# EAGLE schematic Schematic2 (EAGLE 6.5.0)
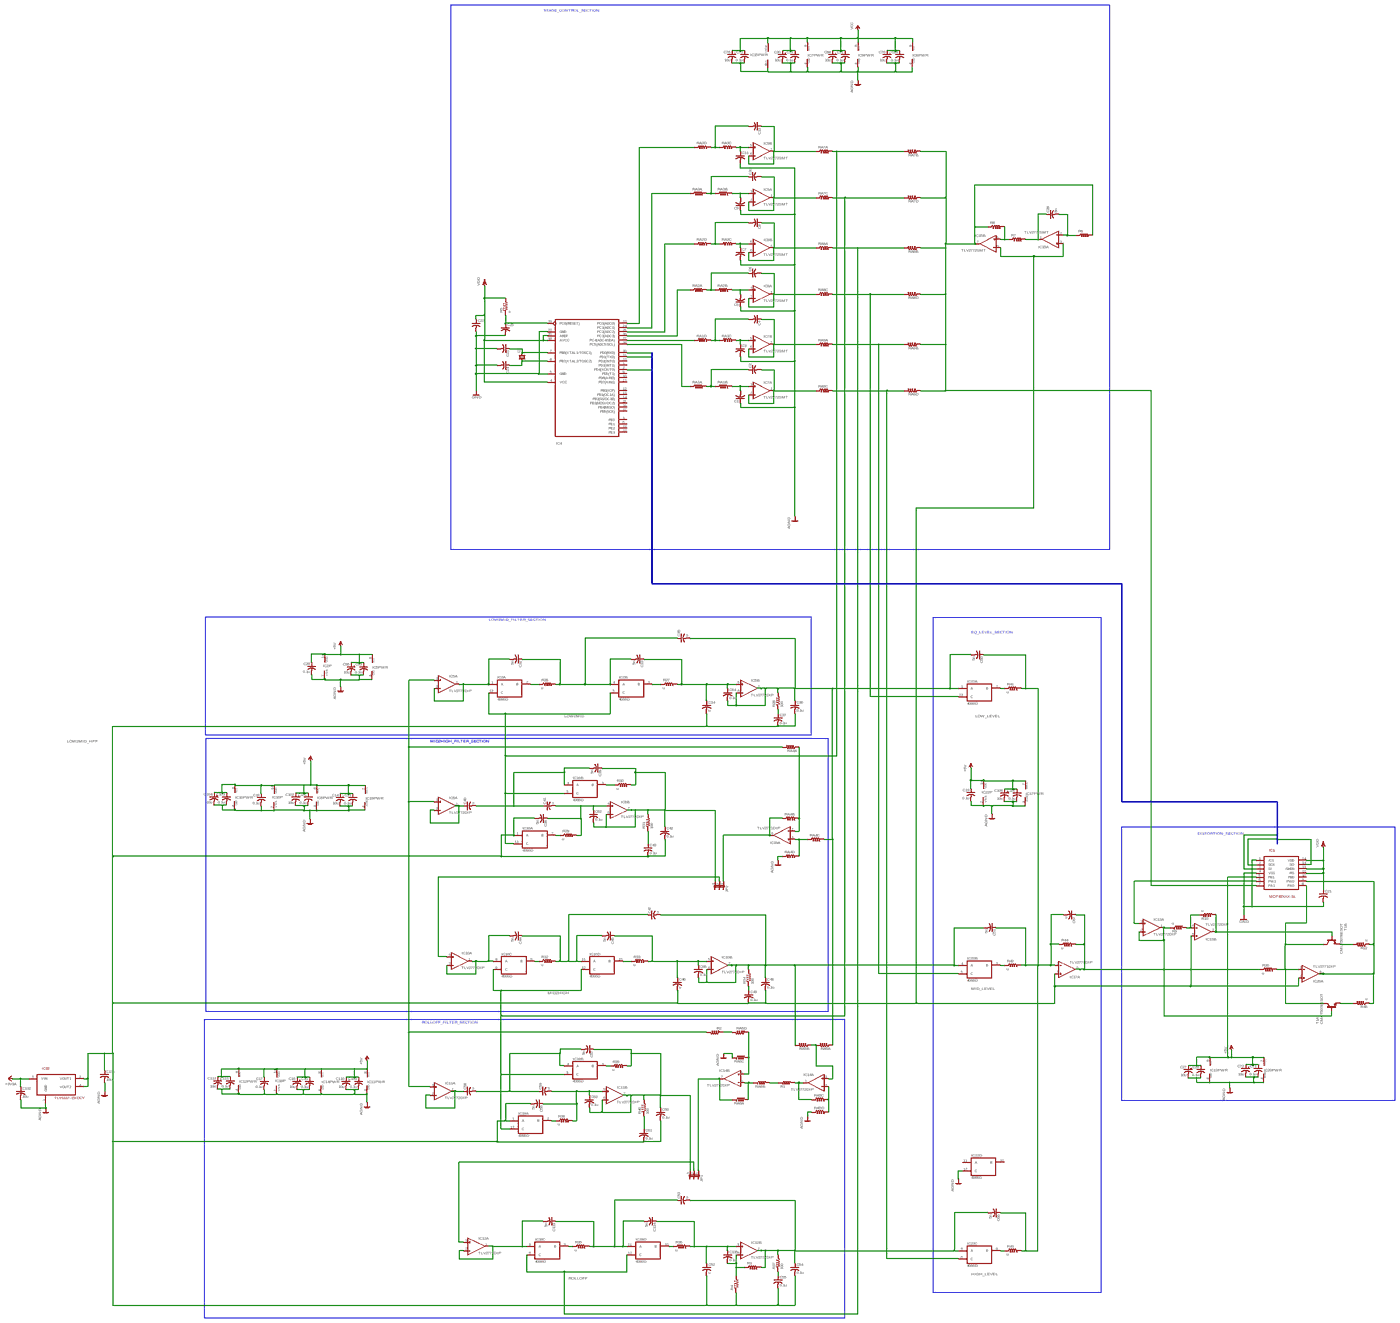
[diagram p0: schematic, sheet 1, overview]
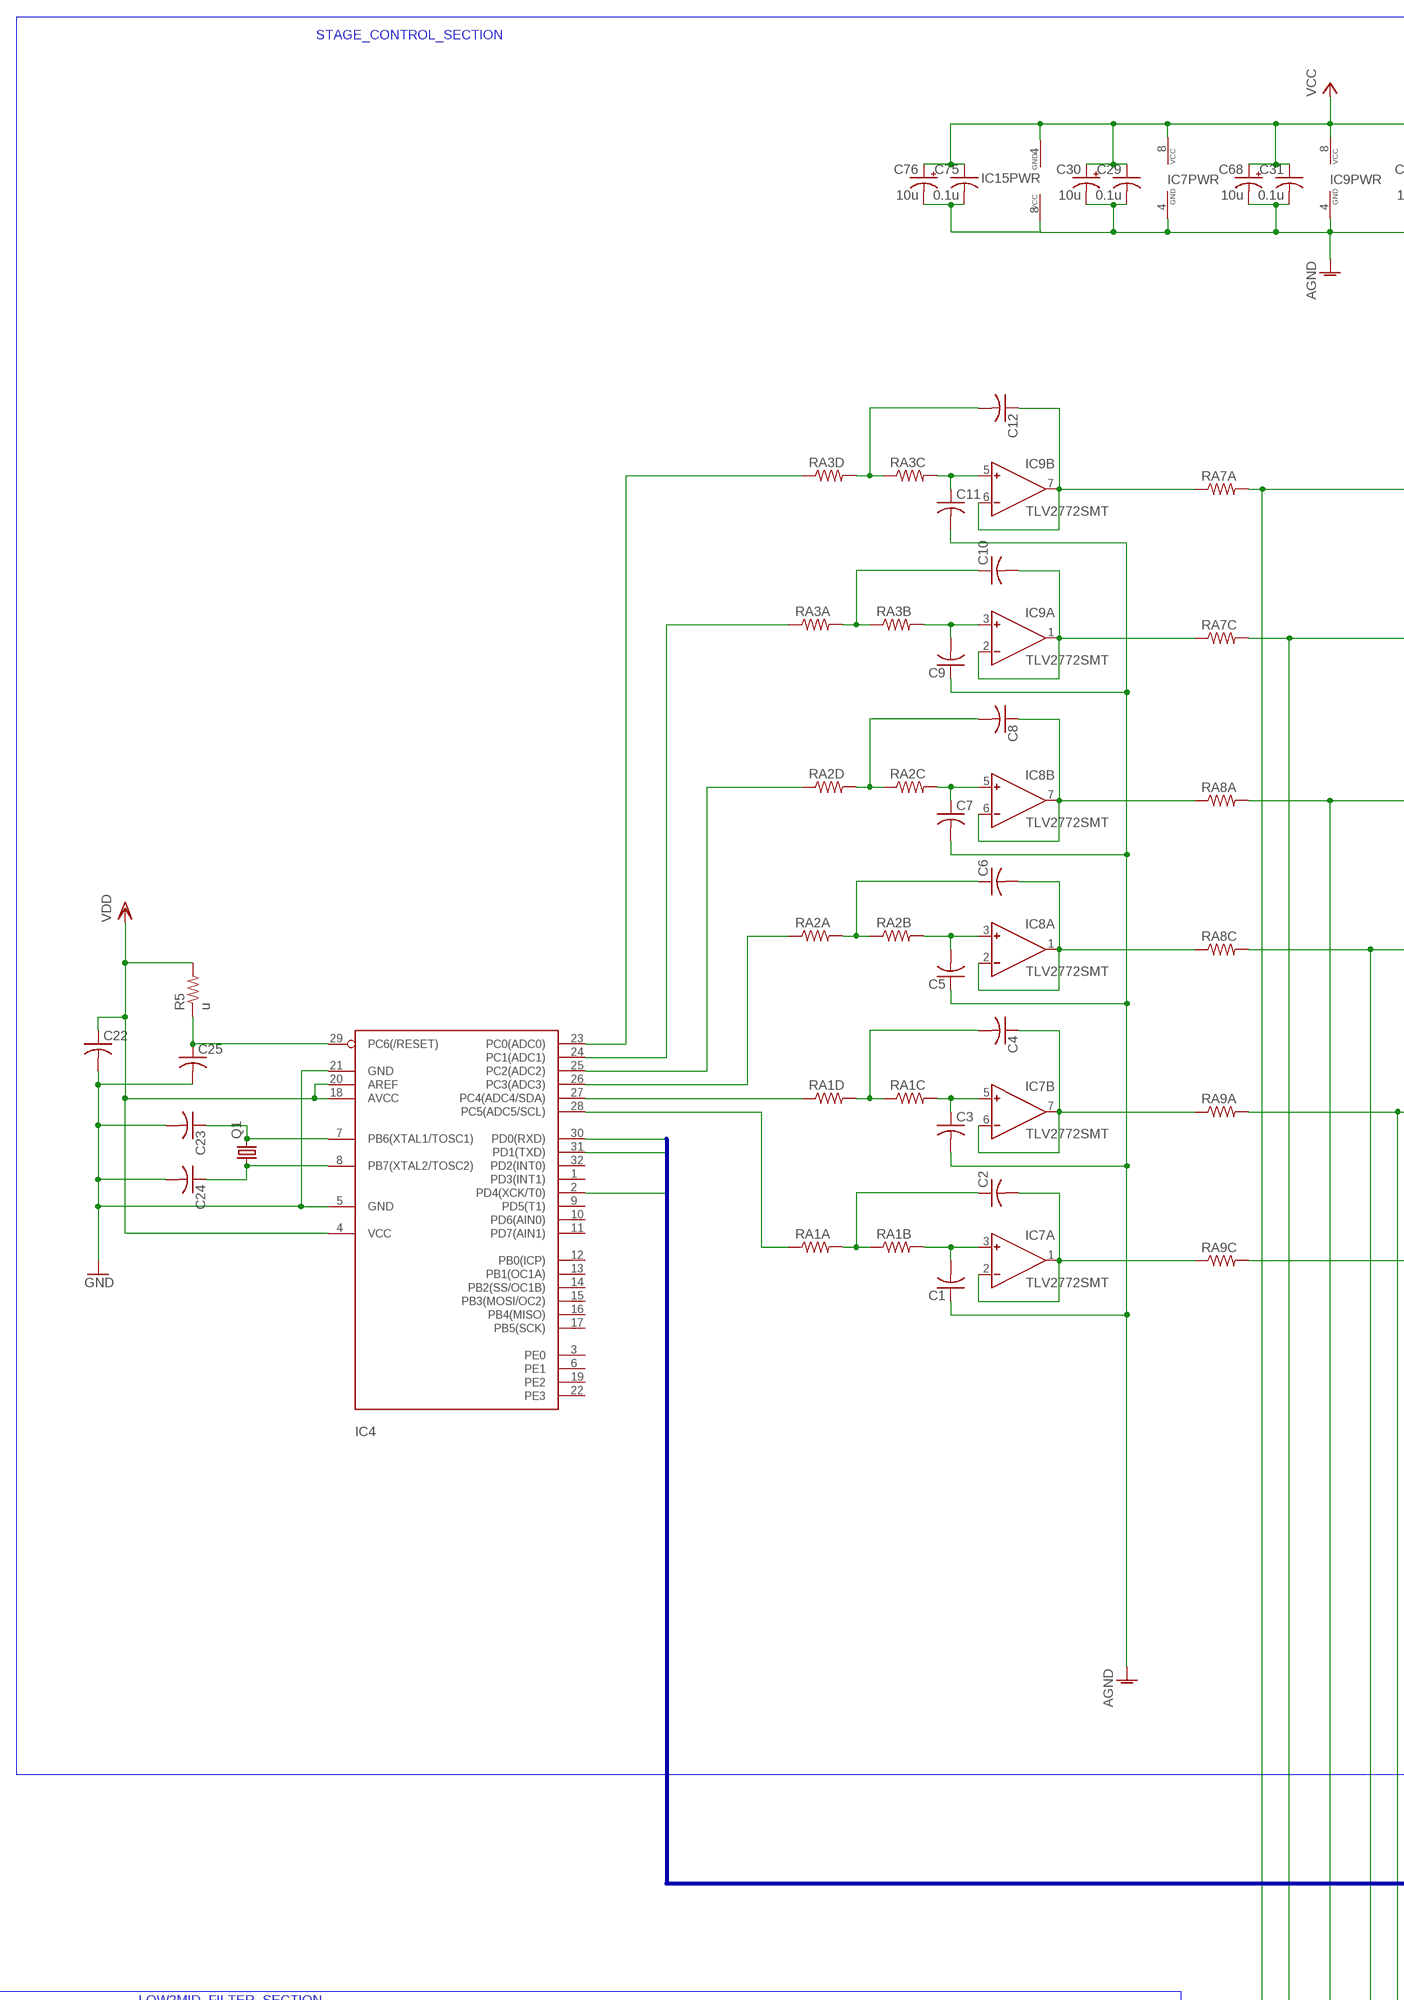
[diagram p1: schematic, sheet 1, part 1 of 4]
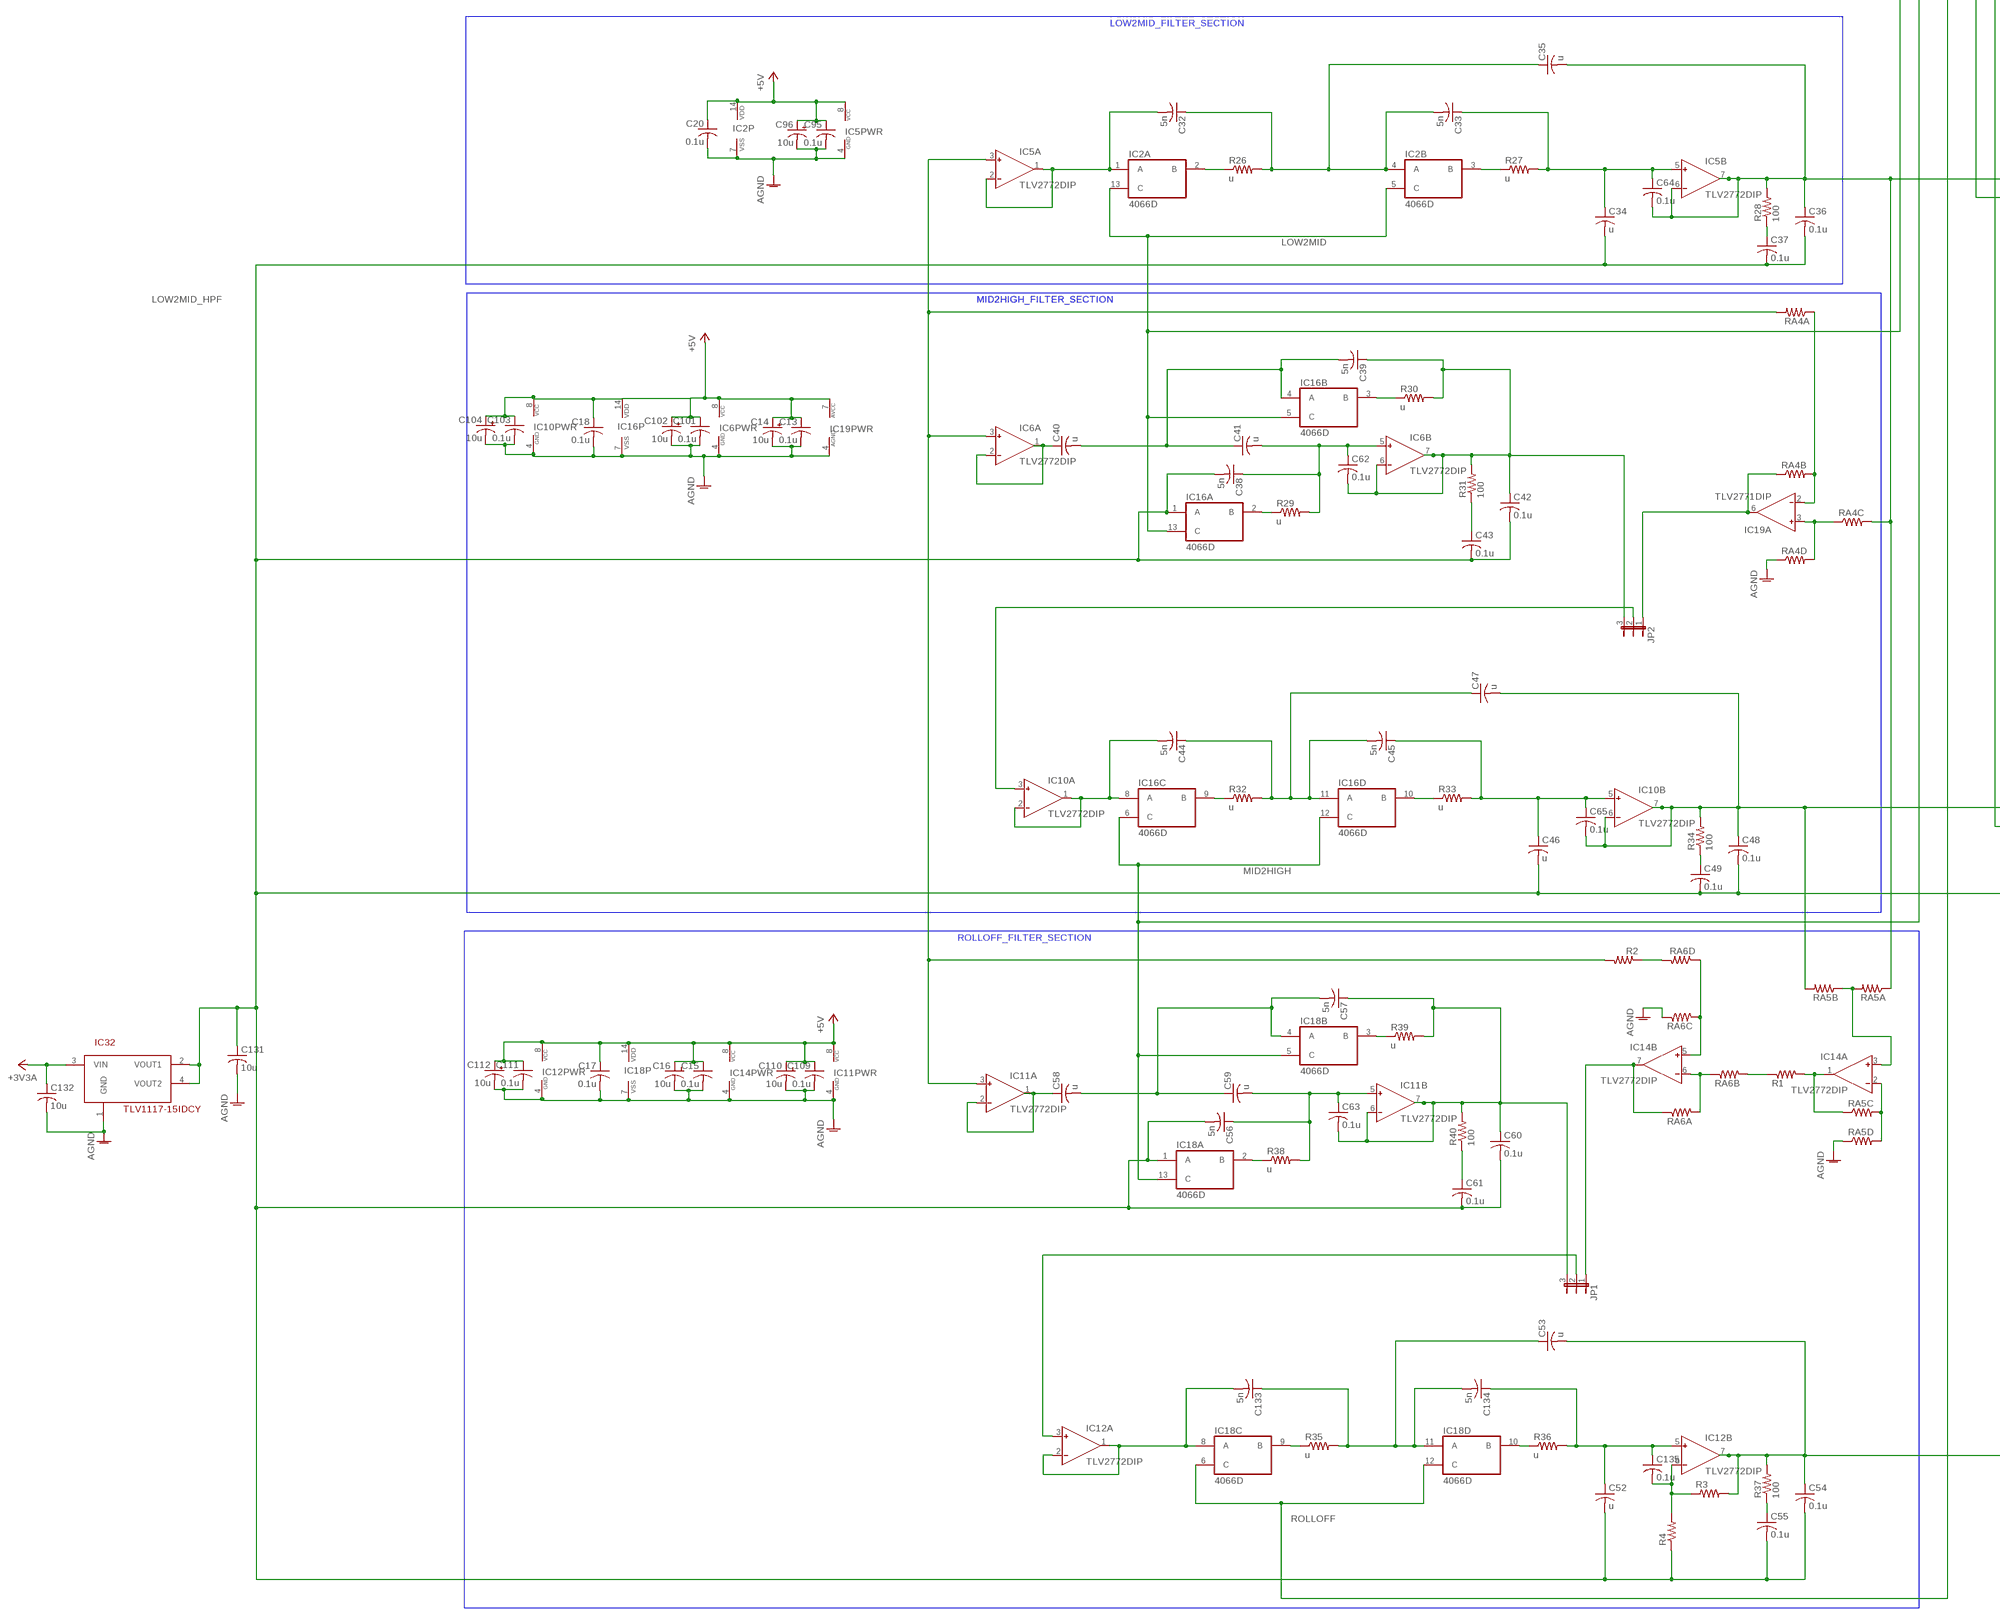
[diagram p2: schematic, sheet 1, part 2 of 4]
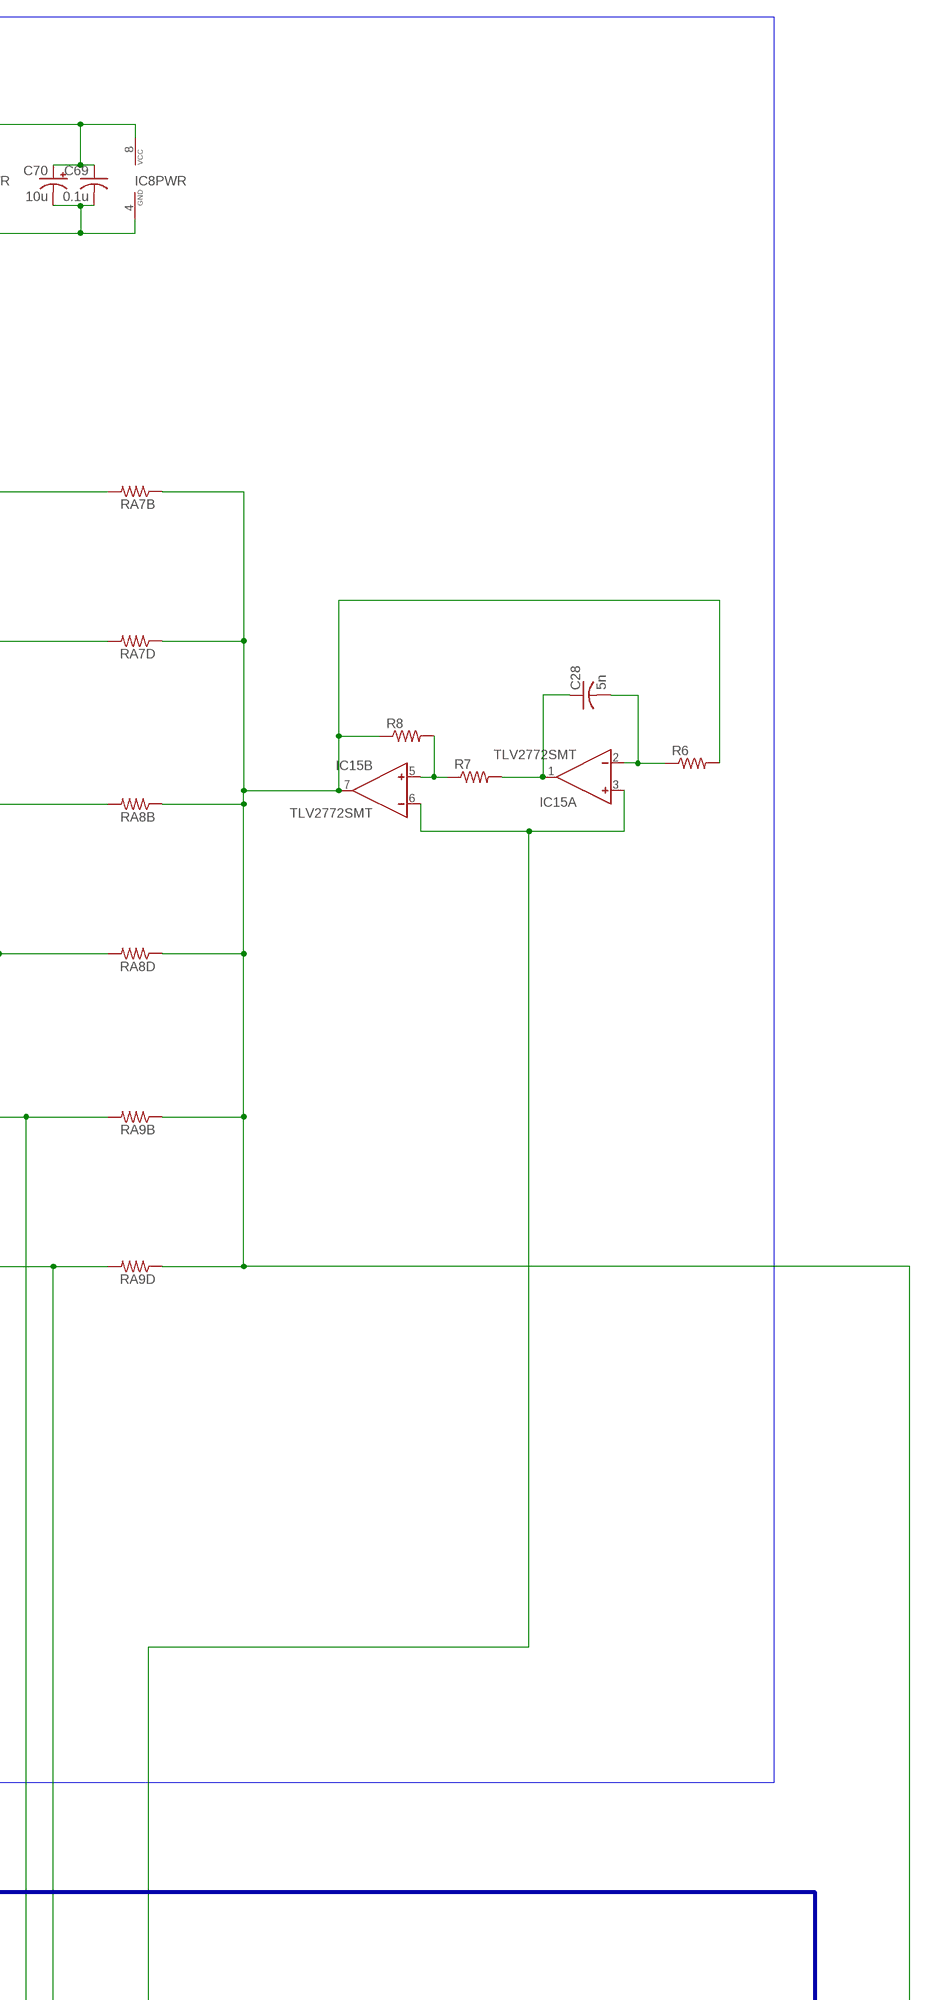
[diagram p3: schematic, sheet 1, part 3 of 4]
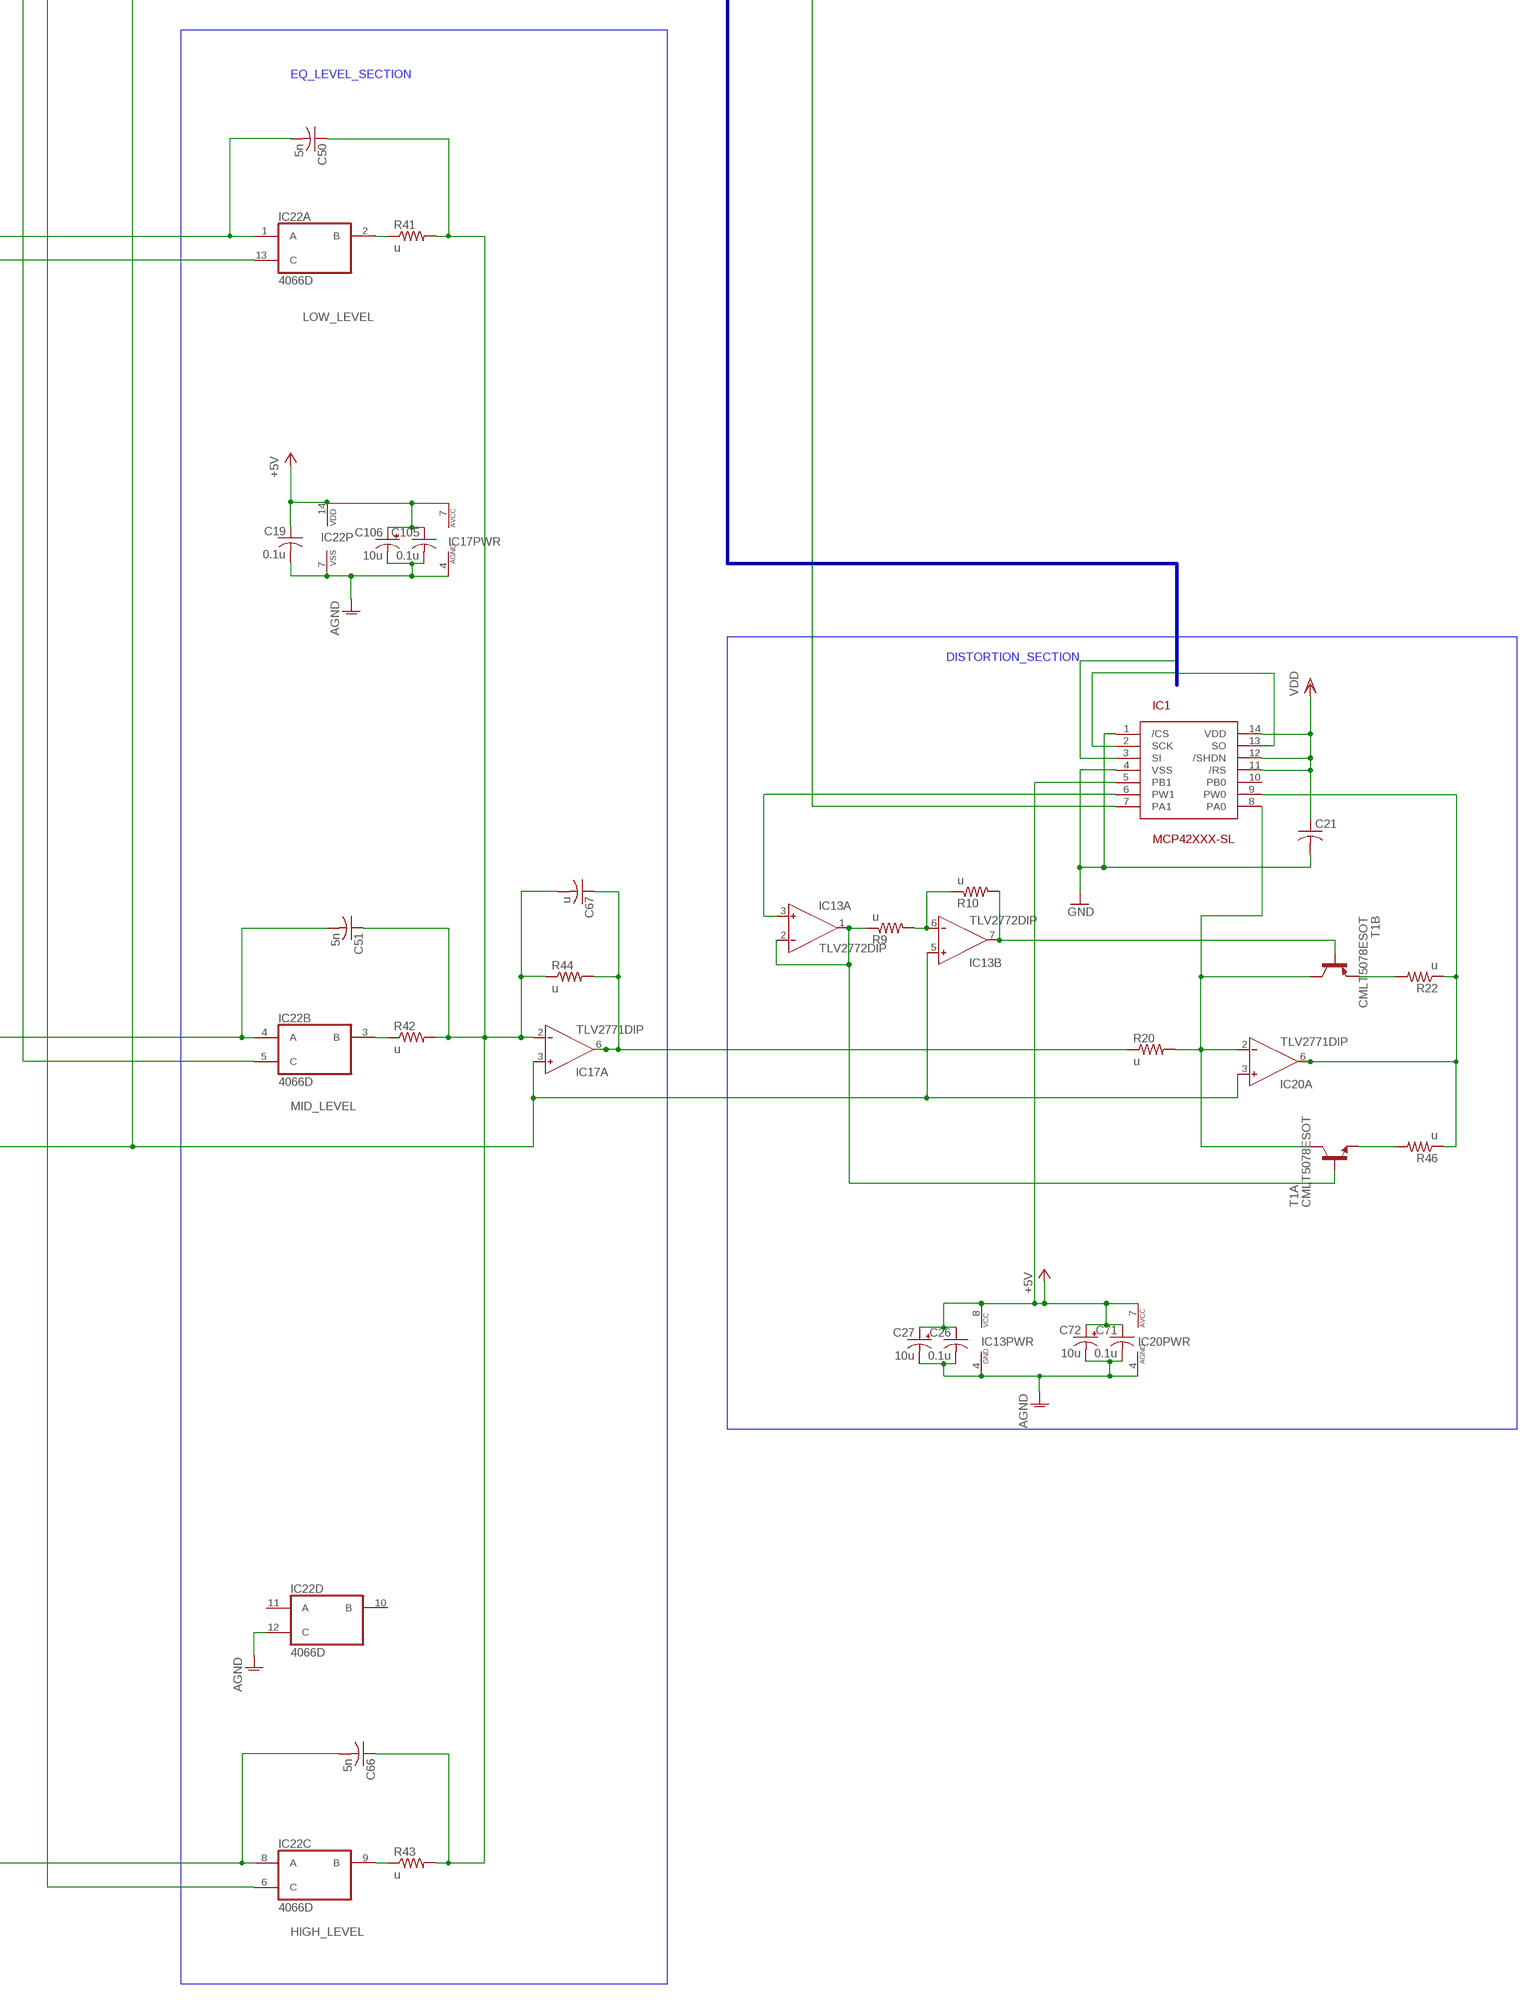
[diagram p4: schematic, sheet 1, part 4 of 4]

## Parts
C1  C-USC0805  [C0805]
C2  C-USC0805  [C0805]
C3  C-USC0805  [C0805]
C4  C-USC0805  [C0805]
C5  C-USC0805  [C0805]
C6  C-USC0805  [C0805]
C7  C-USC0805  [C0805]
C8  C-USC0805  [C0805]
C9  C-USC0805  [C0805]
C10  C-USC0805  [C0805]
C11  C-USC0805  [C0805]
C12  C-USC0805  [C0805]
C13  0.1u  C-USC0805  [C0805]
C14  10u  CPOL-USA/3216-18R  [A/3216-18R]
C15  0.1u  C-USC0805  [C0805]
C16  10u  CPOL-USA/3216-18R  [A/3216-18R]
C17  0.1u  C-USC0805  [C0805]
C18  0.1u  C-USC0805  [C0805]
C19  0.1u  C-USC0805  [C0805]
C20  0.1u  C-USC0805  [C0805]
C21  C-USC0805  [C0805]
C22  C-USC0805  [C0805]
C23  C-USC0805  [C0805]
C24  C-USC0805  [C0805]
C25  C-USC0805  [C0805]
C26  0.1u  C-USC0805  [C0805]
C27  10u  CPOL-USA/3216-18R  [A/3216-18R]
C28  5n  C-USC0805  [C0805]
C29  0.1u  C-USC0805  [C0805]
C30  10u  CPOL-USA/3216-18R  [A/3216-18R]
C31  0.1u  C-USC0805  [C0805]
C32  5n  C-USC0805  [C0805]
C33  5n  C-USC0805  [C0805]
C34  u  C-USC0805  [C0805]
C35  u  C-USC0805  [C0805]
C36  0.1u  C-USC0805  [C0805]
C37  0.1u  C-USC0805  [C0805]
C38  5n  C-USC0805  [C0805]
C39  5n  C-USC0805  [C0805]
C40  u  C-USC0805  [C0805]
C41  u  C-USC0805  [C0805]
C42  0.1u  C-USC0805  [C0805]
C43  0.1u  C-USC0805  [C0805]
C44  5n  C-USC0805  [C0805]
C45  5n  C-USC0805  [C0805]
C46  u  C-USC0805  [C0805]
C47  u  C-USC0805  [C0805]
C48  0.1u  C-USC0805  [C0805]
C49  0.1u  C-USC0805  [C0805]
C50  5n  C-USC0805  [C0805]
C51  5n  C-USC0805  [C0805]
C52  u  C-USC0805  [C0805]
C53  u  C-USC0805  [C0805]
C54  0.1u  C-USC0805  [C0805]
C55  0.1u  C-USC0805  [C0805]
C56  5n  C-USC0805  [C0805]
C57  5n  C-USC0805  [C0805]
C58  u  C-USC0805  [C0805]
C59  u  C-USC0805  [C0805]
C60  0.1u  C-USC0805  [C0805]
C61  0.1u  C-USC0805  [C0805]
C62  0.1u  C-USC0805  [C0805]
C63  0.1u  C-USC0805  [C0805]
C64  0.1u  C-USC0805  [C0805]
C65  0.1u  C-USC0805  [C0805]
C66  5n  C-USC0805  [C0805]
C67  u  C-USC0805  [C0805]
C68  10u  CPOL-USA/3216-18R  [A/3216-18R]
C69  0.1u  C-USC0805  [C0805]
C70  10u  CPOL-USA/3216-18R  [A/3216-18R]
C71  0.1u  C-USC0805  [C0805]
C72  10u  CPOL-USA/3216-18R  [A/3216-18R]
C75  0.1u  C-USC0805  [C0805]
C76  10u  CPOL-USA/3216-18R  [A/3216-18R]
C95  0.1u  C-USC0805  [C0805]
C96  10u  CPOL-USA/3216-18R  [A/3216-18R]
C101  0.1u  C-USC0805  [C0805]
C102  10u  CPOL-USA/3216-18R  [A/3216-18R]
C103  0.1u  C-USC0805  [C0805]
C104  10u  CPOL-USA/3216-18R  [A/3216-18R]
C105  0.1u  C-USC0805  [C0805]
C106  10u  CPOL-USA/3216-18R  [A/3216-18R]
C109  0.1u  C-USC0805  [C0805]
C110  10u  CPOL-USA/3216-18R  [A/3216-18R]
C111  0.1u  C-USC0805  [C0805]
C112  10u  CPOL-USA/3216-18R  [A/3216-18R]
C131  10u  C-USC0805  [C0805]
C132  10u  C-USC0805  [C0805]
C133  5n  C-USC0805  [C0805]
C134  5n  C-USC0805  [C0805]
C135  0.1u  C-USC0805  [C0805]
IC1  MCP42XXX-SL  [SO-14]
IC2  4066D  [SO14]
IC4  ATMEGA168-A  [TQFP32-08]
IC5  TLV2772DIP  [DIL08]
IC6  TLV2772DIP  [DIL08]
IC7  TLV2772SMT  [SO-08]
IC8  TLV2772SMT  [SO-08]
IC9  TLV2772SMT  [SO-08]
IC10  TLV2772DIP  [DIL08]
IC11  TLV2772DIP  [DIL08]
IC12  TLV2772DIP  [DIL08]
IC13  TLV2772DIP  [DIL08]
IC14  TLV2772DIP  [DIL08]
IC15  TLV2772SMT  [SO-08]
IC16  4066D  [SO14]
IC17  TLV2771DIP  [DIL08]
IC18  4066D  [SO14]
IC19  TLV2771DIP  [DIL08]
IC20  TLV2771DIP  [DIL08]
IC22  4066D  [SO14]
IC32  TLV1117-15IDCY  [SOT223-4]
JP1  JP2ES  [JP2]
JP2  JP2ES  [JP2]
Q1  CRYTALHC49UP  [HC49UP]
R1  R-US_R0805  [R0805]
R2  R-US_R0805  [R0805]
R3  R-US_R0805  [R0805]
R4  R-US_R0805  [R0805]
R5  u  R-US_R0805  [R0805]
R6  R-US_R0805  [R0805]
R7  R-US_R0805  [R0805]
R8  R-US_R0805  [R0805]
R9  u  R-US_R0805  [R0805]
R10  u  R-US_R0805  [R0805]
R20  u  R-US_R0805  [R0805]
R22  u  R-US_R0805  [R0805]
R26  u  R-US_R0805  [R0805]
R27  u  R-US_R0805  [R0805]
R28  100  R-US_R0805  [R0805]
R29  u  R-US_R0805  [R0805]
R30  u  R-US_R0805  [R0805]
R31  100  R-US_R0805  [R0805]
R32  u  R-US_R0805  [R0805]
R33  u  R-US_R0805  [R0805]
R34  100  R-US_R0805  [R0805]
R35  u  R-US_R0805  [R0805]
R36  u  R-US_R0805  [R0805]
R37  100  R-US_R0805  [R0805]
R38  u  R-US_R0805  [R0805]
R39  u  R-US_R0805  [R0805]
R40  100  R-US_R0805  [R0805]
R41  u  R-US_R0805  [R0805]
R42  u  R-US_R0805  [R0805]
R43  u  R-US_R0805  [R0805]
R44  u  R-US_R0805  [R0805]
R46  u  R-US_R0805  [R0805]
RA1  4_R2  [YC324]
RA2  4_R2  [YC324]
RA3  4_R2  [YC324]
RA4  4_R2  [YC324]
RA5  4_R2  [YC324]
RA6  4_R2  [YC324]
RA7  4_R2  [YC324]
RA8  4_R2  [YC324]
RA9  4_R2  [YC324]
T1  CMLT5078ESOT  [SOT563]

## Nets
+3V3A: C132.1 IC32.3(VIN)
+5V: C13.1 C14.+ C15.1 C16.+ C17.1 C18.1 C19.1 C20.1 C26.1 C27.+ C71.1 C72.+ C95.1 C96.+ C101.1 C102.+ C103.1 C104.+ C105.1 C106.+ C109.1 C110.+ C111.1 C112.+ IC1.5(PB1) IC2.14(P:VDD) IC5.8(PWR:VCC) IC6.8(PWR:VCC) IC10.8(PWR:VCC) IC11.8(PWR:VCC) IC12.8(PWR:VCC) IC13.8(PWR:VCC) IC14.8(PWR:VCC) IC16.14(P:VDD) IC17.7(PWR:AVCC) IC18.14(P:VDD) IC19.7(PWR:AVCC) IC20.7(PWR:AVCC) IC22.14(P:VDD)
AGND: C1.1 C3.2 C5.1 C7.2 C9.1 C11.2 C13.2 C14.- C15.2 C16.- C17.2 C18.2 C19.2 C20.2 C26.2 C27.- C29.2 C30.- C31.2 C68.- C69.2 C70.- C71.2 C72.- C75.2 C76.- C95.2 C96.- C101.2 C102.- C103.2 C104.- C105.2 C106.- C109.2 C110.- C111.2 C112.- C131.2 C132.2 IC2.7(P:VSS) IC5.4(PWR:GND) IC6.4(PWR:GND) IC7.4(PWR:GND) IC8.4(PWR:GND) IC9.4(PWR:GND) IC10.4(PWR:GND) IC11.4(PWR:GND) IC12.4(PWR:GND) IC13.4(PWR:GND) IC14.4(PWR:GND) IC15.8(PWR:VCC) IC16.7(P:VSS) IC17.4(PWR:AGND) IC18.7(P:VSS) IC19.4(PWR:AGND) IC20.4(PWR:AGND) IC22.7(P:VSS) IC32.1(GND) RA4.4 RA5.4 RA6.3
GND: C21.2 C22.2 C23.2 C24.2 C25.2 IC1.1(/CS) IC1.4(VSS) IC4.5(GND) IC4.21(GND)
HIGH_LEVEL_CV: C2.2 IC7.1(A:OUT) IC7.2(A:IN-) RA9.3
LOW2MID: IC2.5(B:C) IC2.13(A:C) IC16.5(B:C) IC16.13(A:C) RA7.7 RA7.8
LOW2MID_CV: C12.1 IC9.6(B:IN-) IC9.7(B:OUT) RA7.1
LOW_LEVEL_CV: C6.2 IC8.1(A:OUT) IC8.2(A:IN-) RA8.3
MID2HIGH: IC16.6(C:C) IC16.12(D:C) IC18.5(B:C) IC18.13(A:C) RA7.5 RA7.6
MID2HIGH_CV: C10.2 IC9.1(A:OUT) IC9.2(A:IN-) RA7.3
MID_LEVEL_CV: C4.1 IC7.6(B:IN-) IC7.7(B:OUT) RA9.1
MISO: IC1.13(SO) IC4.30(PD0(RXD))
MOSI: IC1.3(SI) IC4.31(PD1(TXD))
N$1: IC22.12(D:C)
N$4: IC10.3(A:IN+) JP2.2
N$5: C44.1 C45.2 C47.1 IC16.11(D:A) R32.2
N$6: IC22.2(A:B) R41.1
N$7: IC16.10(D:B) R33.1
N$8: R22.2 T1.4(B:E)
N$9: R46.2 T1.1(A:E)
N$10: C4.2 RA1.3 RA1.5
N$11: IC1.7(PA1) IC15.7(B:OUT) R6.2 R8.1 RA7.2 RA7.4 RA8.2 RA8.4 RA9.2 RA9.4
N$12: IC15.5(B:IN+) R7.1 R8.2
N$13: C2.1 RA1.2 RA1.8
N$14: C3.1 IC7.5(B:IN+) RA1.6
N$15: C1.2 IC7.3(A:IN+) RA1.7
N$16: IC4.24(PC1(ADC1)) RA3.1
N$17: C28.1 IC15.1(A:OUT) R7.2
N$19: C7.1 IC8.5(B:IN+) RA2.6
N$20: C5.2 IC8.3(A:IN+) RA2.7
N$21: C6.1 RA2.2 RA2.8
N$22: C8.2 RA2.3 RA2.5
N$23: C28.2 IC15.2(A:IN-) R6.1
N$25: C11.1 IC9.5(B:IN+) RA3.6
N$26: C9.2 IC9.3(A:IN+) RA3.7
N$27: C10.1 RA3.2 RA3.8
N$28: C12.2 RA3.3 RA3.5
N$29: IC4.27(PC4(ADC4/SDA)) RA1.4
N$30: IC4.28(PC5(ADC5/SCL)) RA1.1
N$31: IC4.25(PC2(ADC2)) RA2.4
N$32: IC4.26(PC3(ADC3)) RA2.1
N$33: IC4.23(PC0(ADC0)) RA3.4
N$34: IC22.3(B:B) R42.1
N$35: IC1.9(PW0) IC20.6(A:OUT) R22.1 R46.1
N$36: C32.2 IC2.1(A:A) IC5.1(A:OUT) IC5.2(A:IN-)
N$37: C44.2 IC10.1(A:OUT) IC10.2(A:IN-) IC16.8(C:A)
N$38: C39.1 C42.1 C62.2 IC6.6(B:IN-) IC6.7(B:OUT) JP2.3 R30.2 R31.2
N$39: C57.1 C60.1 C63.2 IC11.6(B:IN-) IC11.7(B:OUT) JP1.3 R39.2 R40.2
N$40: C133.2 IC12.1(A:OUT) IC12.2(A:IN-) IC18.8(C:A)
N$41: C23.1 IC4.7(PB6(XTAL1/TOSC1)) Q1.2
N$42: IC14.5(B:IN+) RA6.4 RA6.6
N$43: IC19.6(A:OUT) JP2.1 RA4.2
N$44: IC18.2(A:B) R38.1
N$45: IC14.6(B:IN-) RA6.2 RA6.8
N$46: IC14.7(B:OUT) JP1.1 RA6.1
N$47: IC19.3(A:IN+) RA4.3 RA4.5
N$48: IC14.1(A:OUT) R1.2 RA5.3
N$49: IC19.2(A:IN-) RA4.1 RA4.7
N$50: IC14.2(A:IN-) RA5.5 RA5.6
N$51: IC14.3(A:IN+) RA5.2 RA5.8
N$52: IC18.3(B:B) R39.1
N$53: R1.1 RA6.7
N$54: R2.1 RA6.5
N$55: C135.2 IC12.6(B:IN-) R3.1 R4.2
N$56: C24.1 IC4.8(PB7(XTAL2/TOSC2)) Q1.1
N$57: C25.1 IC4.29(PC6(/RESET)) R5.1
N$60: IC22.13(A:C) RA8.5 RA8.6
N$61: IC22.5(B:C) RA9.7 RA9.8
N$62: IC22.6(C:C) RA9.5 RA9.6
N$66 [section]: IC13.1(A:OUT) IC13.2(A:IN-) R9.1 T1.2(A:B)
N$67 [section]: IC13.6(B:IN-) R9.2 R10.1
N$68 [section]: IC1.6(PW1) IC13.3(A:IN+)
N$69: IC2.2(A:B) R26.1
N$70: C32.1 C33.2 C35.1 IC2.4(B:A) R26.2
N$71: C38.1 C41.2 C62.1 IC6.5(B:IN+) R29.2
N$72 [section]: IC13.7(B:OUT) R10.2 T1.5(B:B)
N$73: IC16.9(C:B) R32.1
N$74: C37.1 R28.1
N$75: IC2.3(B:B) R27.1
N$76: C33.1 C34.1 C64.1 IC5.5(B:IN+) R27.2
N$77: IC18.9(C:B) R35.1
N$78: IC16.2(A:B) R29.1
N$79: C35.2 C36.1 C50.2 C64.2 IC5.6(B:IN-) IC5.7(B:OUT) IC22.1(A:A) R28.2 RA4.6 RA5.1
N$80: C39.2 C40.2 C41.1 IC16.4(B:A)
N$81: C57.2 C58.2 C59.1 IC18.4(B:A)
N$82: IC18.10(D:B) R36.1
N$83: IC16.3(B:B) R30.1
N$85: IC1.8(PA0) IC20.2(A:IN-) R20.2 T1.3(B:C) T1.6(A:C)
N$86: C43.1 R31.1
N$90: IC12.3(A:IN+) JP1.2
N$93: C45.1 C46.1 C65.1 IC10.5(B:IN+) R33.2
N$94: C47.2 C48.1 C51.2 C65.2 IC10.6(B:IN-) IC10.7(B:OUT) IC22.4(B:A) R34.2 RA5.7
N$95: C49.1 R34.1
N$97: C50.1 C51.1 C66.1 C67.2 IC17.2(A:IN-) R41.2 R42.2 R43.2 R44.1
N$98: C53.1 C133.1 C134.2 IC18.11(D:A) R35.2
N$99: C61.1 R40.1
N$101: IC22.9(C:B) R43.1
N$102: C52.1 C134.1 C135.1 IC12.5(B:IN+) R36.2
N$103: C53.2 C54.1 C66.2 IC12.7(B:OUT) IC22.8(C:A) R3.2 R37.2
N$104: C55.1 R37.1
N$106: C56.1 C59.2 C63.1 IC11.5(B:IN+) R38.2
N$107: C67.1 IC17.6(A:OUT) R20.1 R44.2
N$108: C40.1 IC6.1(A:OUT) IC6.2(A:IN-)
N$109: C58.1 IC11.1(A:OUT) IC11.2(A:IN-)
N$112: IC5.3(A:IN+) IC6.3(A:IN+) IC11.3(A:IN+) R2.2 RA4.8
ROLLOFF: IC18.6(C:C) IC18.12(D:C) RA8.7 RA8.8
ROLLOFF_CV: C8.1 IC8.6(B:IN-) IC8.7(B:OUT) RA8.1
SCLK: IC1.2(SCK) IC4.2(PD4(XCK/T0))
VCC: C29.1 C30.+ C31.1 C68.+ C69.1 C70.+ C75.1 C76.+ IC7.8(PWR:VCC) IC8.8(PWR:VCC) IC9.8(PWR:VCC) IC15.4(PWR:GND)
VDD: C21.1 C22.1 IC1.11(/RS) IC1.12(/SHDN) IC1.14(VDD) IC4.4(VCC) IC4.18(AVCC) IC4.20(AREF) R5.2
VMID: C34.2 C36.2 C37.2 C38.2 C42.2 C43.2 C46.2 C48.2 C49.2 C52.2 C54.2 C55.2 C56.2 C60.2 C61.2 C131.1 IC13.5(B:IN+) IC15.3(A:IN+) IC15.6(B:IN-) IC16.1(A:A) IC17.3(A:IN+) IC18.1(A:A) IC20.3(A:IN+) IC32.2(VOUT1) IC32.4(VOUT2) R4.1
Unconnected: IC1.10(PB0) IC2.6(C:C) IC2.8(C:A) IC2.9(C:B) IC2.10(D:B) IC2.11(D:A) IC2.12(D:C) IC4.1(PD3(INT1)) IC4.3(PE0) IC4.6(PE1) IC4.9(PD5(T1)) IC4.10(PD6(AIN0)) IC4.11(PD7(AIN1)) IC4.12(PB0(ICP)) IC4.13(PB1(OC1A)) IC4.14(PB2(SS/OC1B)) IC4.15(PB3(MOSI/OC2)) IC4.16(PB4(MISO)) IC4.17(PB5(SCK)) IC4.19(PE2) IC4.22(PE3) IC4.32(PD2(INT0)) IC22.10(D:B) IC22.11(D:A)

## Buses
SCLK,MOSI,MISO

## Notes on the sheet
- STAGE_CONTROL_SECTION
- LOW2MID_FILTER_SECTION
- EQ_LEVEL_SECTION
- LOW2MID | LOW_LEVEL
- LOW2MID_HPF | MID2HIGH_FILTER_SECTION | MID2HIGH_FILTER_SECTION
- DISTORTION_SECTION
- MID_LEVEL
- MID2HIGH
- ROLLOFF_FILTER_SECTION
- HIGH_LEVEL
- ROLLOFF

## Library data of the parts
C1-C13 C15 C17-C26 C28 C29 C31-C67 C69 C71 C75 C95 C101 C103 C105 C109 C111 C131-C135 = rcl:C-US: CAPACITOR, American symbol
C14 C16 C27 C30 C68 C70 C72 C76 C96 C102 C104 C106 C110 C112 = rcl:CPOL-US: POLARIZED CAPACITOR, American symbol
IC1 = microchip:MCP42XXX
IC2 IC16 IC18 IC22 = 40xx:4066: Quad bilateral ANALOG SWITCH
IC4 = atmel:ATMEGA168
IC5-IC15 = texas2:TLV2772
IC17 IC19 IC20 = texas2:TLV2771
IC32 = texas2:TLV1117
JP1 JP2 = jumper:JP2E: JUMPER
Q1 = crystal:CRYTAL: CRYSTAL
R1-R10 R20 R22 R26-R44 R46 = rcl:R-US_: RESISTOR, American symbol
RA1-RA9 = SMT_R_array:4_R
T1 = transistor:CMLT5078E: DUAL COMPLEMENTARY: L78 TRANSISTORS ENHANCED SPECIFICATION PICOmini(TM) SURFACE MOUNT Source: CMLT5078%20SERIES.pdf